# Altium schematic sheet POWERchDoc.SchDoc: POWER
size 420 x 297 mm; SheetNumber: 4; SheetTotal: 11
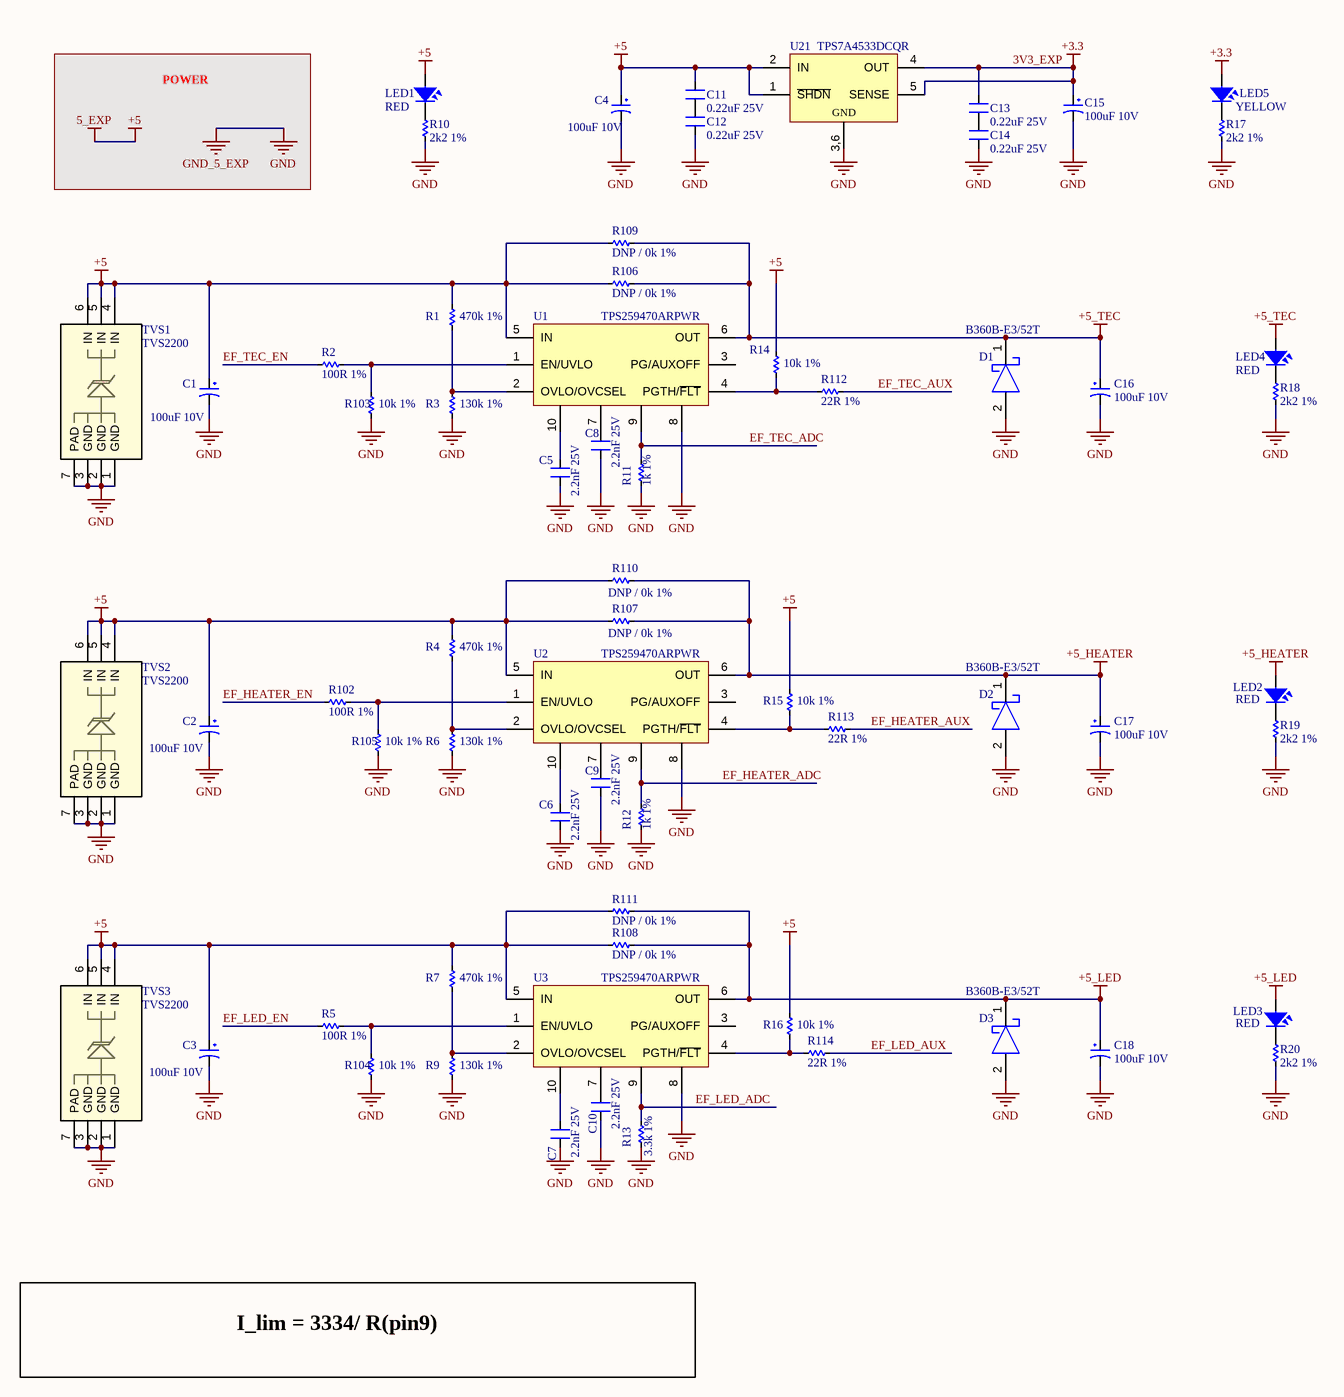
[diagram p0: POWERchDoc.SchDoc]

## Parts
C1  100uF 10V  [TANTALUM_SMD_1206]
C2  100uF 10V  [TANTALUM_SMD_1206]
C3  100uF 10V  [TANTALUM_SMD_1206]
C4  100uF 10V  [TANTALUM_SMD_1206]
C5  2.2nF 25V  [CN-SMD-0603]
C6  2.2nF 25V  [CN-SMD-0603]
C7  2.2nF 25V  [CN-SMD-0603]
C8  2.2nF 25V  [CN-SMD-0603]
C9  2.2nF 25V  [CN-SMD-0603]
C10  2.2nF 25V  [CN-SMD-0603]
C11  0.22uF 25V  [CN-SMD-0603]
C12  0.22uF 25V  [CN-SMD-0603]
C13  0.22uF 25V  [CN-SMD-0603]
C14  0.22uF 25V  [CN-SMD-0603]
C15  100uF 10V  [TANTALUM_SMD_1206]
C16  100uF 10V  [TANTALUM_SMD_1206]
C17  100uF 10V  [TANTALUM_SMD_1206]
C18  100uF 10V  [TANTALUM_SMD_1206]
D1  B360B-E3/52T  [DO214]
D2  B360B-E3/52T  [DO214]
D3  B360B-E3/52T  [DO214]
LED1  RED  [LED_0603_RED]
LED2  RED  [LED_0603_RED]
LED3  RED  [LED_0603_RED]
LED4  RED  [LED_0603_RED]
LED5  YELLOW  [LED_0603_RED]
R1  470k 1%  [RES-SMD-0603]
R2  100R 1%  [RES-SMD-0603]
R3  130k 1%  [RES-SMD-0603]
R4  470k 1%  [RES-SMD-0603]
R5  100R 1%  [RES-SMD-0603]
R6  130k 1%  [RES-SMD-0603]
R7  470k 1%  [RES-SMD-0603]
R9  130k 1%  [RES-SMD-0603]
R10  2k2 1%  [RES-SMD-0603]
R11  1k 1%  [RES-SMD-0603]
R12  1k 1%  [RES-SMD-0603]
R13  3.3k 1%  [RES-SMD-0603]
R14  10k 1%  [RES-SMD-0603]
R15  10k 1%  [RES-SMD-0603]
R16  10k 1%  [RES-SMD-0603]
R17  2k2 1%  [RES-SMD-0603]
R18  2k2 1%  [RES-SMD-0603]
R19  2k2 1%  [RES-SMD-0603]
R20  2k2 1%  [RES-SMD-0603]
R102  100R 1%  [RES-SMD-0603]
R103  10k 1%  [RES-SMD-0603]
R104  10k 1%  [RES-SMD-0603]
R105  10k 1%  [RES-SMD-0603]
R106  DNP / 0k 1%  [RES-SMD-0603]
R107  DNP / 0k 1%  [RES-SMD-0603]
R108  DNP / 0k 1%  [RES-SMD-0603]
R109  DNP / 0k 1%  [RES-SMD-0603]
R110  DNP / 0k 1%  [RES-SMD-0603]
R111  DNP / 0k 1%  [RES-SMD-0603]
R112  22R 1%  [RES-SMD-0603]
R113  22R 1%  [RES-SMD-0603]
R114  22R 1%  [RES-SMD-0603]
TVS1  TVS2200  [TVS2200]
TVS2  TVS2200  [TVS2200]
TVS3  TVS2200  [TVS2200]
U1  TPS259470ARPWR  [VQFN-HR-10]
U2  TPS259470ARPWR  [VQFN-HR-10]
U3  TPS259470ARPWR  [VQFN-HR-10]
U21  TPS7A4533DCQR  [SOT223_6]

## Nets
3V3_EXP: C13.2 C15.1 LED5.1 U21.4(OUT) U21.5(SENSE)  [also labelled +3.3]
+5: C1.1 C2.1 C3.1 C4.1 C11.2 LED1.1 R1.1 R4.1 R7.1 R14.1 R15.1 R16.1 R106.2 R107.2 R108.2 R109.2 R110.2 R111.2 TVS1.4(IN) TVS1.5(IN) TVS1.6(IN) TVS2.4(IN) TVS2.5(IN) TVS2.6(IN) TVS3.4(IN) TVS3.5(IN) TVS3.6(IN) U1.5(IN) U2.5(IN) U3.5(IN) U21.1(~{SHDN}) U21.2(IN)  [also labelled 5_EXP]
+5_HEATER: C17.1 D2.1 LED2.1 R107.1 R110.1 U2.6(OUT)
+5_LED: C18.1 D3.1 LED3.1 R108.1 R111.1 U3.6(OUT)
+5_TEC: C16.1 D1.1 LED4.1 R106.1 R109.1 U1.6(OUT)
GND: C1.2 C2.2 C3.2 C4.2 C5.1 C6.1 C7.1 C8.1 C9.1 C10.1 C12.1 C14.1 C15.2 C16.2 C17.2 C18.2 D1.2 D2.2 D3.2 R3.2 R6.2 R9.2 R10.2 R11.2 R12.2 R13.2 R17.2 R18.2 R19.2 R20.2 R103.2 R104.2 R105.2 TVS1.1(GND) TVS1.2(GND) TVS1.3(GND) TVS1.7(PAD) TVS2.1(GND) TVS2.2(GND) TVS2.3(GND) TVS2.7(PAD) TVS3.1(GND) TVS3.2(GND) TVS3.3(GND) TVS3.7(PAD) U1.8 U2.8 U3.8 U21.3,6(GND)  [also labelled GND_5_EXP]
EF_HEATER_ADC: R12.1 U2.9
EF_HEATER_AUX: R113.2
EF_HEATER_EN: R102.1
EF_LED_ADC: R13.1 U3.9
EF_LED_AUX: R114.2
EF_LED_EN: R5.1
EF_TEC_ADC: R11.1 U1.9
EF_TEC_AUX: R112.2
EF_TEC_EN: R2.1
NetC5_2: C5.2 U1.10
NetC6_2: C6.2 U2.10
NetC7_2: C7.2 U3.10
NetC8_2: C8.2 U1.7
NetC9_2: C9.2 U2.7
NetC10_2: C10.2 U3.7
NetC11_1: C11.1 C12.2
NetC13_1: C13.1 C14.2
NetLED1_2: LED1.2 R10.1
NetLED2_2: LED2.2 R19.1
NetLED3_2: LED3.2 R20.1
NetLED4_2: LED4.2 R18.1
NetLED5_2: LED5.2 R17.1
NetR1_2: R1.2 R3.1 U1.2(OVLO/OVCSEL)
NetR2_2: R2.2 R103.1 U1.1(EN/UVLO)
NetR4_2: R4.2 R6.1 U2.2(OVLO/OVCSEL)
NetR5_2: R5.2 R104.1 U3.1(EN/UVLO)
NetR7_2: R7.2 R9.1 U3.2(OVLO/OVCSEL)
NetR14_2: R14.2 R112.1 U1.4(PGTH/~{FLT})
NetR15_2: R15.2 R113.1 U2.4(PGTH/~{FLT})
NetR16_2: R16.2 R114.1 U3.4(PGTH/~{FLT})
NetR102_2: R102.2 R105.1 U2.1(EN/UVLO)

Not connected (* = marked no-connect by the designer): U1 3(PG/AUXOFF); U2 3(PG/AUXOFF); U3 3(PG/AUXOFF)

## Notes on the sheet
- POWER
- I_lim = 3334/ R(pin9)
- Project:
- BEE-PC1
- Sub-system:
- NANORACK_EXP_CONTROLLER
- Design by:
- SANG HUYNH
- BAO BUI Q.
- Sheet title:
- Sheet
- A3
- of
- Checked by:
- Approved by:
- VU PHAM
- Revision:
- Document No:
- V1.0.0
- Size:
- Date:
- 01/10/2024

## Library data of the parts
C1-C4 C15-C18 = Cap_Tantalum SMD: SMD; Chung_Loai: Dán; Don_Vi: Con; So_Chan: 2; Ten_Linh_Kien: Tụ tantalum 477A-470uF 10V SMD7343; Ma_Hang: MH001956; Kieu_Chan: *
C5-C14 = Capacitors: Value: 33pF
D1-D3 = B360B-E3/52T: DIODE SCHOTTKY 60V 3A DO214AA
LED1-LED5 = LED SMD: Value: LED 3 - 5 ly 2 Colour
R1-R7 R9-R20 R102-R114 = Res SMD: SMD; Manufacturer: Generic Components; Class: Passive; Published: 08/06/2000; Publisher: Altium Hobart Technology Centre
TVS1-TVS3 = TVS2200: UNIDIR PRECISION SURGE DIODE
U21 = TPS7A4533DCQR: IC REG LINEAR 3.3V 1.5A SOT223-6